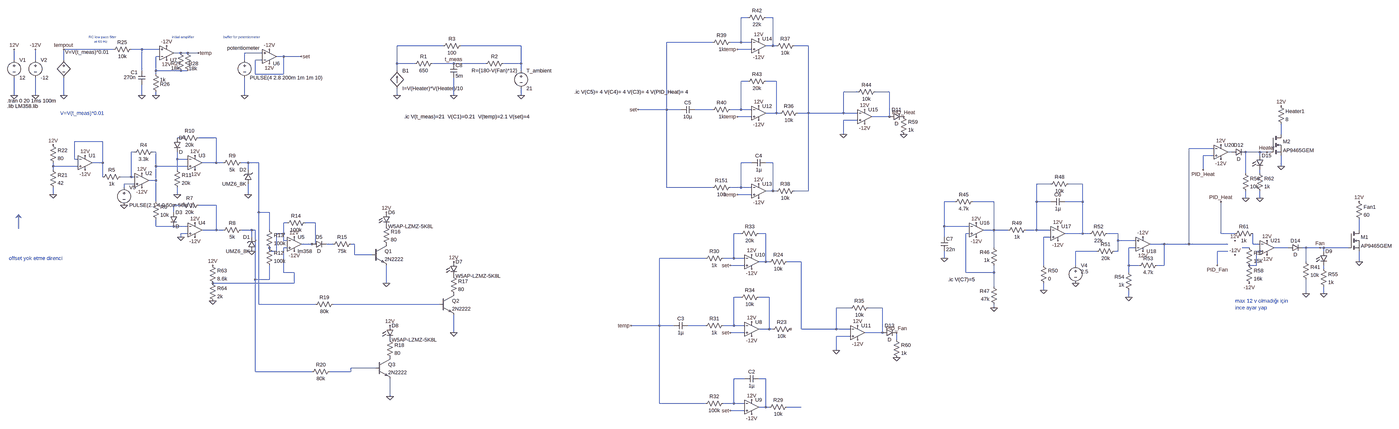
[diagram p0: schematic TRANSFORMERS-ASSEMBLE-3.asc, whole sheet]
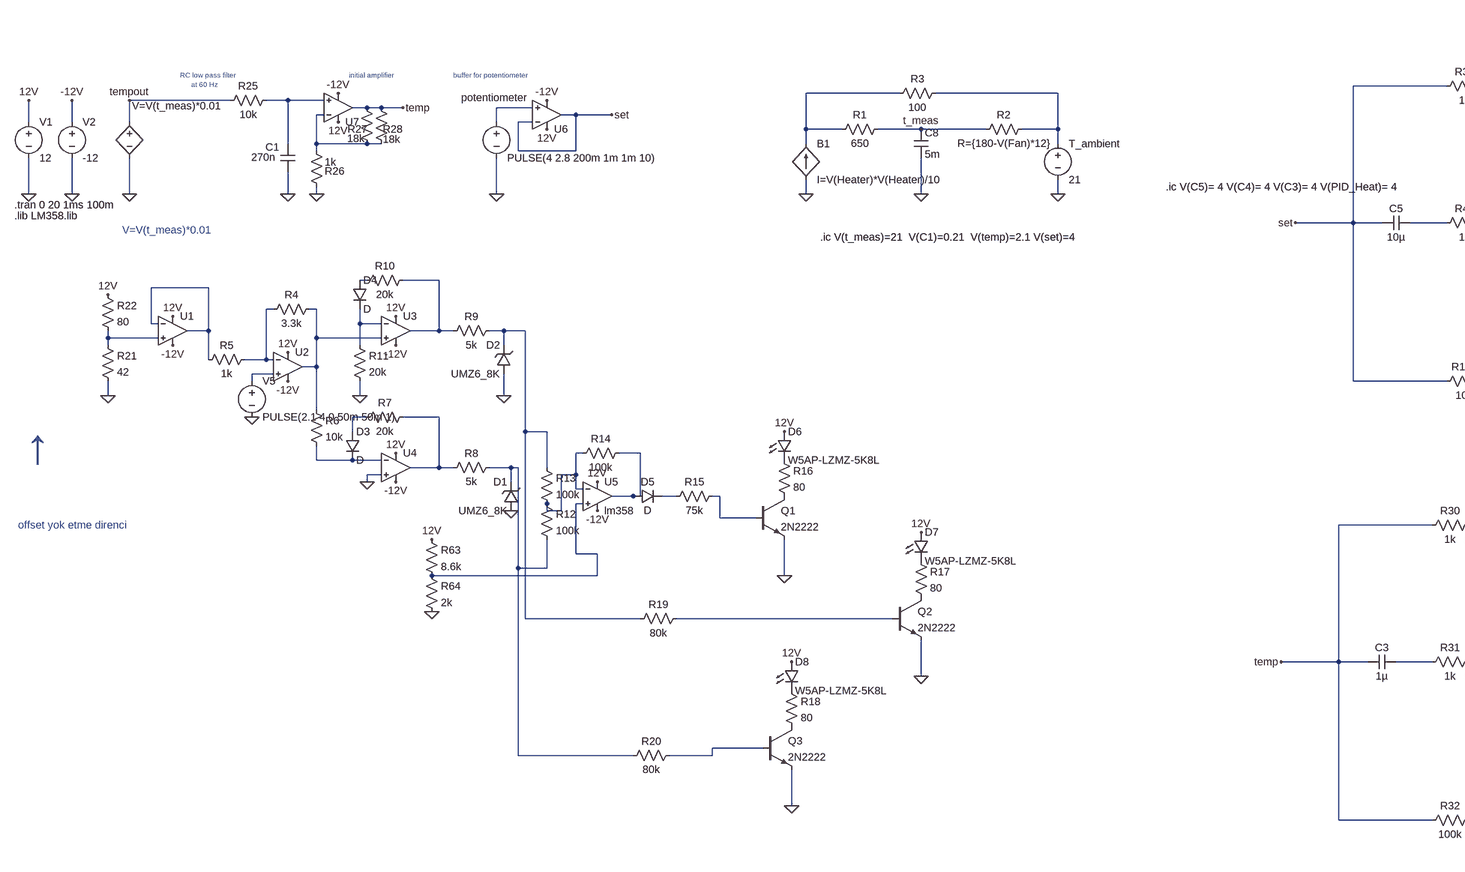
[diagram p1: schematic TRANSFORMERS-ASSEMBLE-3.asc, part, row 1 of 1, column 1 of 2]
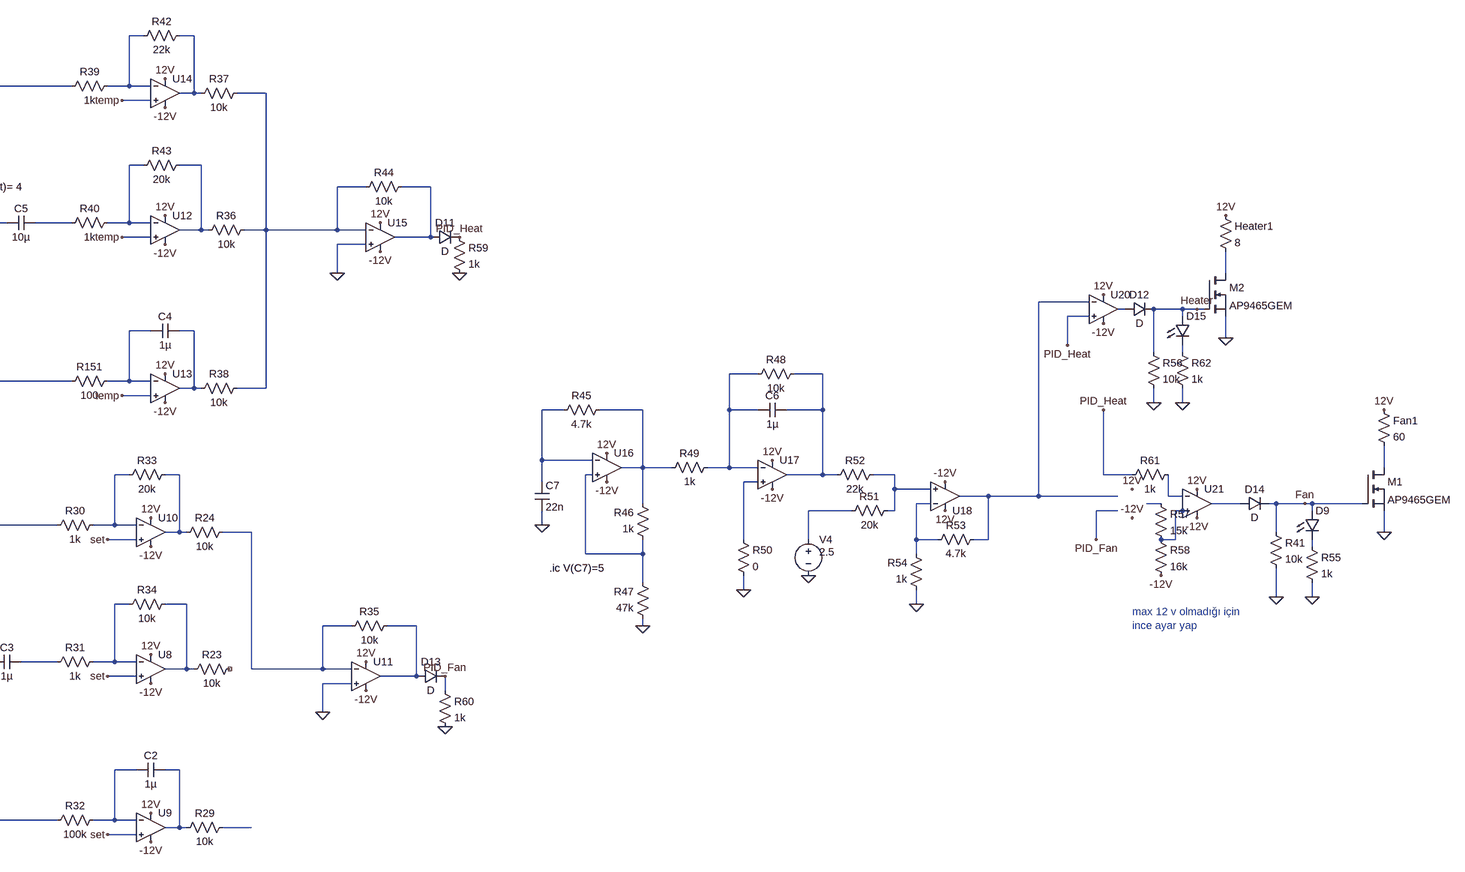
[diagram p2: schematic TRANSFORMERS-ASSEMBLE-3.asc, part, row 1 of 1, column 2 of 2]
TRANSFORMERS-ASSEMBLE-3.asc, the LTspice schematic file:
Version 4
SHEET 1 5384 1732
WIRE 2224 -160 2192 -160
WIRE 2336 -160 2304 -160
WIRE 2064 -48 1856 -48
WIRE 2192 -48 2192 -160
WIRE 2192 -48 2144 -48
WIRE 2240 -48 2192 -48
WIRE 576 -32 368 -32
WIRE 928 -32 656 -32
WIRE 2336 -32 2336 -160
WIRE 2336 -32 2304 -32
WIRE 2352 -32 2336 -32
WIRE 2496 -32 2432 -32
WIRE -912 -16 -1136 -16
WIRE -784 -16 -832 -16
WIRE -704 -16 -784 -16
WIRE 2240 -16 2176 -16
WIRE -608 0 -640 0
WIRE -576 0 -608 0
WIRE -528 0 -576 0
WIRE -240 0 -320 0
WIRE -704 16 -720 16
WIRE -144 16 -176 16
WIRE -64 16 -144 16
WIRE -1360 32 -1360 -16
WIRE -1264 32 -1264 -16
WIRE -1136 32 -1136 -16
WIRE -320 32 -320 0
WIRE -240 32 -272 32
WIRE 368 48 368 -32
WIRE 448 48 368 48
WIRE 624 48 528 48
WIRE 768 48 624 48
WIRE 928 48 928 -32
WIRE 928 48 848 48
WIRE -784 80 -784 -16
WIRE -720 80 -720 16
WIRE -608 80 -720 80
WIRE -576 80 -608 80
WIRE 368 80 368 48
WIRE 928 80 928 48
WIRE -720 96 -720 80
WIRE -272 96 -272 32
WIRE -144 96 -144 16
WIRE -144 96 -272 96
WIRE 2224 128 2192 128
WIRE 2352 128 2304 128
WIRE 2720 176 2656 176
WIRE 2864 176 2800 176
WIRE -1360 192 -1360 112
WIRE -1264 192 -1264 112
WIRE -1136 192 -1136 112
WIRE -784 192 -784 144
WIRE -720 192 -720 176
WIRE -320 192 -320 112
WIRE 368 192 368 160
WIRE 624 192 624 112
WIRE 928 192 928 160
WIRE 1856 256 1856 -48
WIRE 1856 256 1728 256
WIRE 1920 256 1856 256
WIRE 2064 256 1984 256
WIRE 2192 256 2192 128
WIRE 2192 256 2144 256
WIRE 2240 256 2192 256
WIRE 2352 272 2352 128
WIRE 2352 272 2304 272
WIRE 2368 272 2352 272
WIRE 2496 272 2496 -32
WIRE 2496 272 2448 272
WIRE 2656 272 2656 176
WIRE 2656 272 2496 272
WIRE 2720 272 2656 272
WIRE 2240 288 2176 288
WIRE 2864 288 2864 176
WIRE 2864 288 2784 288
WIRE 2720 304 2656 304
WIRE 2656 368 2656 304
WIRE 4880 368 4880 320
WIRE -608 384 -624 384
WIRE -448 384 -528 384
WIRE -960 400 -1088 400
WIRE 4576 432 4464 432
WIRE -816 448 -832 448
WIRE -720 448 -736 448
WIRE 4656 448 4640 448
WIRE 4784 448 4720 448
WIRE 4816 448 4784 448
WIRE 4832 448 4816 448
WIRE 4576 464 4528 464
WIRE 4784 464 4784 448
WIRE -1088 480 -1088 400
WIRE -1072 480 -1088 480
WIRE -624 480 -624 448
WIRE -576 480 -624 480
WIRE -960 496 -960 400
WIRE -960 496 -1008 496
WIRE -448 496 -448 384
WIRE -448 496 -512 496
WIRE -416 496 -448 496
WIRE -304 496 -336 496
WIRE -256 496 -304 496
WIRE 2240 496 2192 496
WIRE 2336 496 2304 496
WIRE -1184 512 -1184 496
WIRE -1072 512 -1184 512
WIRE -720 512 -720 448
WIRE -576 512 -720 512
WIRE 4880 512 4880 464
WIRE -1184 528 -1184 512
WIRE -624 528 -624 480
WIRE -304 528 -304 496
WIRE 4528 528 4528 464
WIRE 4720 544 4720 448
WIRE 4784 544 4784 528
WIRE -960 560 -960 496
WIRE -832 560 -832 448
WIRE -832 560 -880 560
WIRE -816 560 -832 560
WIRE -720 576 -720 512
WIRE -720 576 -752 576
WIRE -816 592 -864 592
WIRE 3840 592 3776 592
WIRE 3984 592 3920 592
WIRE -864 608 -864 592
WIRE 1856 608 1856 256
WIRE 2064 608 1856 608
WIRE 2192 608 2192 496
WIRE 2192 608 2144 608
WIRE 2240 608 2192 608
WIRE 2336 624 2336 496
WIRE 2336 624 2304 624
WIRE 2352 624 2336 624
WIRE 2496 624 2496 272
WIRE 2496 624 2432 624
WIRE -1184 640 -1184 608
WIRE -624 640 -624 608
WIRE -304 640 -304 592
WIRE 2240 640 2176 640
WIRE 4720 656 4720 624
WIRE 4784 656 4784 624
WIRE -720 672 -720 576
WIRE 3408 672 3360 672
WIRE 3584 672 3488 672
WIRE 3776 672 3776 592
WIRE 3840 672 3776 672
WIRE 3984 672 3984 592
WIRE 3984 672 3904 672
WIRE -608 688 -640 688
WIRE -448 688 -528 688
WIRE -640 720 -640 688
WIRE -256 720 -256 496
WIRE -208 720 -256 720
WIRE -128 768 -144 768
WIRE 0 768 -48 768
WIRE -720 784 -720 752
WIRE -640 784 -720 784
WIRE -576 784 -640 784
WIRE 3360 784 3360 672
WIRE 3472 784 3360 784
WIRE -448 800 -448 688
WIRE -448 800 -512 800
WIRE -416 800 -448 800
WIRE -288 800 -336 800
WIRE -272 800 -288 800
WIRE -208 800 -208 720
WIRE 3584 800 3584 672
WIRE 3584 800 3536 800
WIRE 3648 800 3584 800
WIRE 3776 800 3776 672
WIRE 3776 800 3728 800
WIRE 3840 800 3776 800
WIRE 5232 800 5232 752
WIRE -576 816 -608 816
WIRE -144 816 -144 768
WIRE -144 816 -176 816
WIRE 2192 816 2160 816
WIRE 2304 816 2272 816
WIRE 3472 816 3456 816
WIRE 3984 816 3984 672
WIRE 3984 816 3904 816
WIRE 4016 816 3984 816
WIRE 4144 816 4096 816
WIRE 4608 816 4608 672
WIRE 4672 816 4608 816
WIRE -608 832 -608 816
WIRE -288 832 -288 800
WIRE 3360 832 3360 784
WIRE 3840 832 3808 832
WIRE -144 848 -144 816
WIRE -128 848 -144 848
WIRE 4144 848 4144 816
WIRE 4224 848 4144 848
WIRE -16 864 -64 864
WIRE 0 864 0 768
WIRE 0 864 -16 864
WIRE 80 864 48 864
WIRE 176 864 160 864
WIRE 4352 864 4288 864
WIRE 4464 864 4464 432
WIRE 4464 864 4352 864
WIRE 4640 864 4464 864
WIRE 4752 864 4752 816
WIRE 4784 864 4752 864
WIRE -128 880 -144 880
WIRE 3584 880 3584 800
WIRE 4224 880 4192 880
WIRE 4736 880 4704 880
WIRE 4912 880 4848 880
WIRE 4992 880 4976 880
WIRE 5056 880 4992 880
WIRE 5072 880 5056 880
WIRE 5184 880 5072 880
WIRE -208 896 -208 880
WIRE -176 896 -176 816
WIRE -176 896 -208 896
WIRE 4048 896 3952 896
WIRE 4144 896 4144 848
WIRE 4144 896 4128 896
WIRE 4640 896 4592 896
WIRE 4784 896 4768 896
WIRE 4800 896 4784 896
WIRE 5072 896 5072 880
WIRE 176 912 176 864
WIRE 256 912 176 912
WIRE 2032 928 1824 928
WIRE 2160 928 2160 816
WIRE 2160 928 2112 928
WIRE 2208 928 2160 928
WIRE 3360 928 3360 896
WIRE 2304 944 2304 816
WIRE 2304 944 2272 944
WIRE 2320 944 2304 944
WIRE 2464 944 2400 944
WIRE 4992 944 4992 880
WIRE 5232 944 5232 896
WIRE 2208 960 2144 960
WIRE 3808 960 3808 832
WIRE 3952 960 3952 896
WIRE 4192 960 4192 880
WIRE 4240 960 4192 960
WIRE 4352 960 4352 864
WIRE 4352 960 4320 960
WIRE 4592 960 4592 896
WIRE 4768 960 4768 896
WIRE 4768 960 4736 960
WIRE 5072 976 5072 960
WIRE -144 992 -144 880
WIRE -96 992 -144 992
WIRE 3456 992 3456 816
WIRE 3584 992 3584 960
WIRE 3584 992 3456 992
WIRE 4192 992 4192 960
WIRE -272 1024 -272 800
WIRE -208 1024 -208 960
WIRE -208 1024 -272 1024
WIRE -96 1040 -96 992
WIRE -96 1040 -464 1040
WIRE 320 1040 320 960
WIRE 3584 1056 3584 992
WIRE 3808 1072 3808 1040
WIRE 4992 1088 4992 1024
WIRE 5072 1088 5072 1056
WIRE 2192 1104 2160 1104
WIRE 2320 1104 2272 1104
WIRE 4192 1104 4192 1072
WIRE -256 1136 -256 720
WIRE 0 1136 -256 1136
WIRE 560 1136 80 1136
WIRE 2688 1152 2624 1152
WIRE 2832 1152 2768 1152
WIRE 3584 1152 3584 1136
WIRE 1824 1232 1824 928
WIRE 1824 1232 1696 1232
WIRE 1888 1232 1824 1232
WIRE 2032 1232 1952 1232
WIRE 2160 1232 2160 1104
WIRE 2160 1232 2112 1232
WIRE 2208 1232 2160 1232
WIRE 2320 1248 2320 1104
WIRE 2320 1248 2272 1248
WIRE 2336 1248 2320 1248
WIRE 2464 1248 2464 944
WIRE 2624 1248 2624 1152
WIRE 2624 1248 2464 1248
WIRE 2688 1248 2624 1248
WIRE 624 1264 624 1184
WIRE 2208 1264 2144 1264
WIRE 2832 1264 2832 1152
WIRE 2832 1264 2752 1264
WIRE 2688 1280 2624 1280
WIRE 2896 1296 2896 1264
WIRE 2624 1344 2624 1280
WIRE 272 1424 160 1424
WIRE -272 1440 -272 1024
WIRE -16 1440 -272 1440
WIRE 160 1440 160 1424
WIRE 160 1440 64 1440
WIRE 2208 1472 2160 1472
WIRE 2304 1472 2272 1472
WIRE 336 1552 336 1472
WIRE 1824 1584 1824 1232
WIRE 2032 1584 1824 1584
WIRE 2160 1584 2160 1472
WIRE 2160 1584 2112 1584
WIRE 2208 1584 2160 1584
WIRE 2304 1600 2304 1472
WIRE 2304 1600 2272 1600
WIRE 2320 1600 2304 1600
WIRE 2464 1600 2400 1600
WIRE 2208 1616 2144 1616
FLAG -1360 192 0
FLAG -1360 -16 12V
FLAG -1264 192 0
FLAG -1264 -16 -12V
FLAG -1136 192 0
FLAG -672 -32 -12V
FLAG -672 32 12V
FLAG -784 192 0
FLAG -720 192 0
FLAG -528 0 temp
FLAG -320 192 0
FLAG -208 -16 -12V
FLAG -208 48 12V
FLAG -64 16 set
FLAG 928 192 0
FLAG 368 192 0
FLAG 624 192 0
FLAG -784 608 -12V
FLAG -784 544 12V
FLAG -1184 640 0
FLAG -1184 416 12V
FLAG -608 832 0
FLAG -544 832 -12V
FLAG -544 768 12V
FLAG -288 896 0
FLAG -304 640 0
FLAG -544 528 -12V
FLAG -544 464 12V
FLAG -624 640 0
FLAG -96 896 -12V
FLAG -96 832 12V
FLAG 320 1040 0
FLAG 320 720 12V
FLAG 624 1264 0
FLAG 624 944 12V
FLAG 336 1552 0
FLAG 336 1232 12V
FLAG -1040 528 -12V
FLAG -1040 464 12V
FLAG 624 48 t_meas
FLAG -1136 -16 tempout
FLAG 2240 1280 -12V
FLAG 2240 1216 12V
FLAG 2240 1632 -12V
FLAG 2240 1568 12V
FLAG 2240 976 -12V
FLAG 2240 912 12V
FLAG 2720 1232 12V
FLAG 2624 1344 0
FLAG 2896 1264 PID_Fan
FLAG 2272 304 -12V
FLAG 2272 240 12V
FLAG 2272 656 -12V
FLAG 2272 592 12V
FLAG 2272 0 -12V
FLAG 2272 -64 12V
FLAG 2752 320 -12V
FLAG 2752 256 12V
FLAG 1728 256 set
FLAG 2656 368 0
FLAG 2928 288 PID_Heat
FLAG 3504 832 -12V
FLAG 3504 768 12V
FLAG 3360 928 0
FLAG 3584 1152 0
FLAG 3808 1072 0
FLAG 3872 848 -12V
FLAG 3872 784 12V
FLAG 4256 832 -12V
FLAG 4256 896 12V
FLAG 4192 1104 0
FLAG 4672 912 -12V
FLAG 4672 848 12V
FLAG 4592 960 PID_Fan
FLAG 5056 880 Fan
FLAG 5232 944 0
FLAG 5072 1088 0
FLAG 4608 480 -12V
FLAG 4608 416 12V
FLAG 4528 528 PID_Heat
FLAG 4816 448 Heater
FLAG 4880 512 0
FLAG 4720 656 0
FLAG 5232 672 12V
FLAG 4880 240 12V
FLAG 4816 912 -12V
FLAG 4816 848 12V
FLAG 4608 672 PID_Heat
FLAG 4736 1040 -12V
FLAG 3952 1040 0
FLAG 2176 -16 temp
FLAG 2176 288 temp
FLAG 2176 640 temp
FLAG 2928 368 0
FLAG 2896 1376 0
FLAG 2720 1296 -12V
FLAG 4992 1088 0
FLAG 2144 960 set
FLAG 2144 1264 set
FLAG 2144 1616 set
FLAG 1696 1232 temp
FLAG 4784 656 0
FLAG -864 688 0
FLAG -464 1120 0
FLAG -464 960 12V
SYMBOL voltage -1360 16 R0
SYMATTR InstName V1
SYMATTR Value 12
SYMBOL voltage -1264 16 R0
WINDOW 123 0 0 Left 0
WINDOW 39 0 0 Left 0
SYMATTR InstName V2
SYMATTR Value -12
SYMBOL bv -1136 16 R0
WINDOW 0 -36 10 Invisible 2
WINDOW 3 6 -20 Left 2
SYMATTR InstName B2
SYMATTR Value V=V(t_meas)*0.01
SYMBOL res -816 -32 R90
WINDOW 0 0 56 VBottom 2
WINDOW 3 32 56 VTop 2
SYMATTR InstName R25
SYMATTR Value 10k
SYMBOL cap -800 80 R0
WINDOW 0 -34 8 Left 2
WINDOW 3 -65 30 Left 2
SYMATTR InstName C1
SYMATTR Value 270n
SYMBOL res -736 80 R0
WINDOW 0 34 61 Left 2
WINDOW 3 34 41 Left 2
SYMATTR InstName R26
SYMATTR Value 1k
SYMBOL res -624 -16 R0
WINDOW 0 -27 64 Left 2
WINDOW 3 -28 85 Left 2
SYMATTR InstName R27
SYMATTR Value 18k
SYMBOL res -592 -16 R0
WINDOW 0 19 64 Left 2
WINDOW 3 19 86 Left 2
SYMATTR InstName R28
SYMATTR Value 18k
SYMBOL voltage -320 16 R0
WINDOW 0 -79 -38 Left 2
WINDOW 123 0 0 Left 0
WINDOW 39 0 0 Left 0
SYMATTR InstName potentiometer
SYMATTR Value PULSE(4 2.8 200m 1m 1m 10)
SYMBOL voltage 928 64 R0
WINDOW 123 0 0 Left 0
WINDOW 39 0 0 Left 0
SYMATTR InstName T_ambient
SYMATTR Value 21
SYMBOL res 544 32 R90
WINDOW 0 0 56 VBottom 2
WINDOW 3 32 56 VTop 2
SYMATTR InstName R1
SYMATTR Value 650
SYMBOL res 864 32 R90
WINDOW 0 0 56 VBottom 2
WINDOW 3 32 56 VTop 2
SYMATTR InstName R2
SYMATTR Value R={180-V(Fan)*12}
SYMBOL res 672 -48 R90
WINDOW 0 0 56 VBottom 2
WINDOW 3 32 56 VTop 2
SYMATTR InstName R3
SYMATTR Value 100
SYMBOL res -720 432 R90
WINDOW 0 0 56 VBottom 2
WINDOW 3 32 56 VTop 2
SYMATTR InstName R4
SYMATTR Value 3.3k
SYMBOL res -864 544 R90
WINDOW 0 0 56 VBottom 2
WINDOW 3 32 56 VTop 2
SYMATTR InstName R5
SYMATTR Value 1k
SYMBOL res -736 656 R0
SYMATTR InstName R6
SYMATTR Value 10k
SYMBOL res -512 672 R90
WINDOW 0 0 56 VBottom 2
WINDOW 3 32 56 VTop 2
SYMATTR InstName R7
SYMATTR Value 20k
SYMBOL zener -272 896 R180
WINDOW 0 24 64 Left 2
WINDOW 3 24 0 Left 2
SYMATTR InstName D1
SYMATTR Value UMZ6_8K
SYMBOL res -320 784 R90
WINDOW 0 0 56 VBottom 2
WINDOW 3 32 56 VTop 2
SYMATTR InstName R8
SYMATTR Value 5k
SYMBOL zener -288 592 R180
WINDOW 0 24 64 Left 2
WINDOW 3 24 0 Left 2
SYMATTR InstName D2
SYMATTR Value UMZ6_8K
SYMBOL res -320 480 R90
WINDOW 0 0 56 VBottom 2
WINDOW 3 32 56 VTop 2
SYMATTR InstName R9
SYMATTR Value 5k
SYMBOL res -512 368 R90
WINDOW 0 0 56 VBottom 2
WINDOW 3 32 56 VTop 2
SYMATTR InstName R10
SYMATTR Value 20k
SYMBOL res -640 512 R0
SYMATTR InstName R11
SYMATTR Value 20k
SYMBOL diode -656 720 R0
SYMATTR InstName D3
SYMBOL diode -640 384 R0
SYMATTR InstName D4
SYMBOL res -224 864 R0
SYMATTR InstName R12
SYMATTR Value 100k
SYMBOL res -224 784 R0
SYMATTR InstName R13
SYMATTR Value 100k
SYMBOL res -32 752 R90
WINDOW 0 0 56 VBottom 2
WINDOW 3 32 56 VTop 2
SYMATTR InstName R14
SYMATTR Value 100k
SYMBOL diode -16 880 R270
WINDOW 0 32 32 VTop 2
WINDOW 3 0 32 VBottom 2
SYMATTR InstName D5
SYMBOL npn 256 864 R0
SYMATTR InstName Q1
SYMATTR Value 2N2222
SYMBOL res 176 848 R90
WINDOW 0 0 56 VBottom 2
WINDOW 3 32 56 VTop 2
SYMATTR InstName R15
SYMATTR Value 75k
SYMBOL LED 304 720 R0
SYMATTR InstName D6
SYMATTR Value W5AP-LZMZ-5K8L
SYMATTR Description Diode
SYMATTR Type diode
SYMBOL res 304 768 R0
SYMATTR InstName R16
SYMATTR Value 80
SYMBOL npn 560 1088 R0
SYMATTR InstName Q2
SYMATTR Value 2N2222
SYMBOL LED 608 944 R0
SYMATTR InstName D7
SYMATTR Value W5AP-LZMZ-5K8L
SYMATTR Description Diode
SYMATTR Type diode
SYMBOL res 608 992 R0
SYMATTR InstName R17
SYMATTR Value 80
SYMBOL npn 272 1376 R0
SYMATTR InstName Q3
SYMATTR Value 2N2222
SYMBOL LED 320 1232 R0
SYMATTR InstName D8
SYMATTR Value W5AP-LZMZ-5K8L
SYMATTR Description Diode
SYMATTR Type diode
SYMBOL res 320 1280 R0
SYMATTR InstName R18
SYMATTR Value 80
SYMBOL res 96 1120 R90
WINDOW 0 0 56 VBottom 2
WINDOW 3 32 56 VTop 2
SYMATTR InstName R19
SYMATTR Value 80k
SYMBOL res 80 1424 R90
WINDOW 0 0 56 VBottom 2
WINDOW 3 32 56 VTop 2
SYMATTR InstName R20
SYMATTR Value 80k
SYMBOL res -1200 512 R0
SYMATTR InstName R21
SYMATTR Value 42
SYMBOL res -1200 400 R0
SYMATTR InstName R22
SYMATTR Value 80
SYMBOL Opamps\\UniversalOpamp2 -1040 496 R0
SYMATTR InstName U1
SYMBOL Opamps\\UniversalOpamp2 -784 576 R0
SYMATTR InstName U2
SYMBOL Opamps\\UniversalOpamp2 -544 496 R0
SYMATTR InstName U3
SYMBOL Opamps\\UniversalOpamp2 -544 800 R0
SYMATTR InstName U4
SYMBOL Opamps\\UniversalOpamp2 2240 1248 R0
SYMATTR InstName U8
SYMBOL Opamps\\UniversalOpamp2 2240 1600 R0
SYMATTR InstName U9
SYMBOL Opamps\\UniversalOpamp2 2240 944 R0
SYMATTR InstName U10
SYMBOL Opamps\\UniversalOpamp2 2720 1264 R0
SYMATTR InstName U11
SYMBOL res 2432 1232 R90
WINDOW 0 0 56 VBottom 2
WINDOW 3 32 56 VTop 2
SYMATTR InstName R23
SYMATTR Value 10k
SYMBOL res 2416 928 R90
WINDOW 0 0 56 VBottom 2
WINDOW 3 32 56 VTop 2
SYMATTR InstName R24
SYMATTR Value 10k
SYMBOL res 2416 1584 R90
WINDOW 0 0 56 VBottom 2
WINDOW 3 32 56 VTop 2
SYMATTR InstName R29
SYMATTR Value 10k
SYMBOL res 2128 912 R90
WINDOW 0 0 56 VBottom 2
WINDOW 3 32 56 VTop 2
SYMATTR InstName R30
SYMATTR Value 1k
SYMBOL res 2128 1216 R90
WINDOW 0 0 56 VBottom 2
WINDOW 3 32 56 VTop 2
SYMATTR InstName R31
SYMATTR Value 1k
SYMBOL res 2128 1568 R90
WINDOW 0 0 56 VBottom 2
WINDOW 3 32 56 VTop 2
SYMATTR InstName R32
SYMATTR Value 100k
SYMBOL res 2288 800 R90
WINDOW 0 0 56 VBottom 2
WINDOW 3 32 56 VTop 2
SYMATTR InstName R33
SYMATTR Value 20k
SYMBOL res 2288 1088 R90
WINDOW 0 0 56 VBottom 2
WINDOW 3 32 56 VTop 2
SYMATTR InstName R34
SYMATTR Value 10k
SYMBOL cap 2272 1456 R90
WINDOW 0 0 32 VBottom 2
WINDOW 3 32 32 VTop 2
SYMATTR InstName C2
SYMATTR Value 1µ
SYMBOL cap 1952 1216 R90
WINDOW 0 0 32 VBottom 2
WINDOW 3 32 32 VTop 2
SYMATTR InstName C3
SYMATTR Value 1µ
SYMBOL res 2784 1136 R90
WINDOW 0 0 56 VBottom 2
WINDOW 3 32 56 VTop 2
SYMATTR InstName R35
SYMATTR Value 10k
SYMBOL Opamps\\UniversalOpamp2 2272 272 R0
SYMATTR InstName U12
SYMBOL Opamps\\UniversalOpamp2 2272 624 R0
SYMATTR InstName U13
SYMBOL Opamps\\UniversalOpamp2 2272 -32 R0
SYMATTR InstName U14
SYMBOL Opamps\\UniversalOpamp2 2752 288 R0
SYMATTR InstName U15
SYMBOL res 2448 -48 R90
WINDOW 0 0 56 VBottom 2
WINDOW 3 32 56 VTop 2
SYMATTR InstName R37
SYMATTR Value 10k
SYMBOL res 2448 608 R90
WINDOW 0 0 56 VBottom 2
WINDOW 3 32 56 VTop 2
SYMATTR InstName R38
SYMATTR Value 10k
SYMBOL res 2160 -64 R90
WINDOW 0 0 56 VBottom 2
WINDOW 3 32 56 VTop 2
SYMATTR InstName R39
SYMATTR Value 1k
SYMBOL res 2160 240 R90
WINDOW 0 0 56 VBottom 2
WINDOW 3 32 56 VTop 2
SYMATTR InstName R40
SYMATTR Value 1k
SYMBOL res 2160 592 R90
WINDOW 0 0 56 VBottom 2
WINDOW 3 32 56 VTop 2
SYMATTR InstName R151
SYMATTR Value 100
SYMBOL res 2320 -176 R90
WINDOW 0 0 56 VBottom 2
WINDOW 3 32 56 VTop 2
SYMATTR InstName R42
SYMATTR Value 22k
SYMBOL res 2320 112 R90
WINDOW 0 0 56 VBottom 2
WINDOW 3 32 56 VTop 2
SYMATTR InstName R43
SYMATTR Value 20k
SYMBOL cap 2304 480 R90
WINDOW 0 0 32 VBottom 2
WINDOW 3 32 32 VTop 2
SYMATTR InstName C4
SYMATTR Value 1µ
SYMBOL cap 1984 240 R90
WINDOW 0 0 32 VBottom 2
WINDOW 3 32 32 VTop 2
SYMATTR InstName C5
SYMATTR Value 10µ
SYMBOL res 2816 160 R90
WINDOW 0 0 56 VBottom 2
WINDOW 3 32 56 VTop 2
SYMATTR InstName R44
SYMATTR Value 10k
SYMBOL cap 3904 656 R90
WINDOW 0 0 32 VBottom 2
WINDOW 3 32 32 VTop 2
SYMATTR InstName C6
SYMATTR Value 1µ
SYMBOL res 3504 656 R90
WINDOW 0 0 56 VBottom 2
WINDOW 3 32 56 VTop 2
SYMATTR InstName R45
SYMATTR Value 4.7k
SYMBOL res 3600 976 R180
WINDOW 0 36 76 Left 2
WINDOW 3 36 40 Left 2
SYMATTR InstName R46
SYMATTR Value 1k
SYMBOL res 3600 1152 R180
WINDOW 0 36 76 Left 2
WINDOW 3 36 40 Left 2
SYMATTR InstName R47
SYMATTR Value 47k
SYMBOL res 3936 576 R90
WINDOW 0 0 56 VBottom 2
WINDOW 3 32 56 VTop 2
SYMATTR InstName R48
SYMATTR Value 10k
SYMBOL Opamps\\UniversalOpamp2 3504 800 R0
SYMATTR InstName U16
SYMBOL res 3744 784 R90
WINDOW 0 0 56 VBottom 2
WINDOW 3 32 56 VTop 2
SYMATTR InstName R49
SYMATTR Value 1k
SYMBOL res 3792 944 R0
SYMATTR InstName R50
SYMATTR Value 0
SYMBOL res 4144 880 R90
WINDOW 0 0 56 VBottom 2
WINDOW 3 32 56 VTop 2
SYMATTR InstName R51
SYMATTR Value 20k
SYMBOL res 4000 832 R270
WINDOW 0 32 56 VTop 2
WINDOW 3 0 56 VBottom 2
SYMATTR InstName R52
SYMATTR Value 22k
SYMBOL Opamps\\UniversalOpamp2 3872 816 R0
SYMATTR InstName U17
SYMBOL Opamps\\UniversalOpamp2 4256 864 M180
SYMATTR InstName U18
SYMBOL res 4336 944 R90
WINDOW 0 0 56 VBottom 2
WINDOW 3 32 56 VTop 2
SYMATTR InstName R53
SYMATTR Value 4.7k
SYMBOL res 4208 1088 R180
WINDOW 0 36 76 Left 2
WINDOW 3 36 40 Left 2
SYMATTR InstName R54
SYMATTR Value 1k
SYMBOL nmos 5184 800 R0
SYMATTR InstName M1
SYMATTR Value AP9465GEM
SYMBOL LED 5056 896 R0
WINDOW 3 24 64 Invisible 2
SYMATTR Value NSSW008CT-P1
SYMATTR InstName D9
SYMATTR Description Diode
SYMATTR Type diode
SYMBOL res 5056 960 R0
SYMATTR InstName R55
SYMATTR Value 1k
SYMBOL res 5216 656 R0
SYMATTR InstName Fan1
SYMATTR Value 60
SYMBOL Opamps\\UniversalOpamp2 4608 448 R0
SYMATTR InstName U20
SYMBOL nmos 4832 368 R0
SYMATTR InstName M2
SYMATTR Value AP9465GEM
SYMBOL res 4704 528 R0
SYMATTR InstName R56
SYMATTR Value 10k
SYMBOL res 4864 224 R0
SYMATTR InstName Heater1
SYMATTR Value 8
SYMBOL Opamps\\UniversalOpamp2 4816 880 R0
SYMATTR InstName U21
SYMBOL res 4720 864 R0
SYMATTR InstName R57
SYMATTR Value 15k
SYMBOL res 4720 944 R0
SYMATTR InstName R58
SYMATTR Value 16k
SYMBOL voltage 3952 944 R0
WINDOW 123 0 0 Left 0
WINDOW 39 0 0 Left 0
WINDOW 3 24 44 Left 2
SYMATTR Value 2.5
SYMATTR InstName V4
SYMBOL cap 3344 832 R0
SYMATTR InstName C7
SYMATTR Value 22n
SYMBOL cap 608 48 R0
SYMATTR InstName C8
SYMATTR Value 5m
SYMBOL bi2 368 80 R0
SYMATTR InstName B1
SYMATTR Value I=V(Heater)*V(Heater)/10
SYMBOL diode 4656 464 R270
WINDOW 0 32 32 VTop 2
WINDOW 3 0 32 VBottom 2
SYMATTR InstName D12
SYMBOL diode 2864 304 R270
WINDOW 0 32 32 VTop 2
WINDOW 3 0 32 VBottom 2
SYMATTR InstName D11
SYMBOL diode 2832 1280 R270
WINDOW 0 32 32 VTop 2
WINDOW 3 0 32 VBottom 2
SYMATTR InstName D13
SYMBOL diode 4912 896 R270
WINDOW 0 32 32 VTop 2
WINDOW 3 0 32 VBottom 2
SYMATTR InstName D14
SYMBOL res 2912 272 R0
SYMATTR InstName R59
SYMATTR Value 1k
SYMBOL res 2880 1280 R0
SYMATTR InstName R60
SYMATTR Value 1k
SYMBOL Opamps\\UniversalOpamp2 -208 16 M180
SYMATTR InstName U6
SYMBOL Opamps\\UniversalOpamp2 -672 0 M180
SYMATTR InstName U7
SYMBOL res 4976 928 R0
SYMATTR InstName R41
SYMATTR Value 10k
SYMBOL res 4768 800 R90
WINDOW 0 0 56 VBottom 2
WINDOW 3 32 56 VTop 2
SYMATTR InstName R61
SYMATTR Value 1k
SYMBOL res 4768 528 R0
SYMATTR InstName R62
SYMATTR Value 1k
SYMBOL LED 4768 464 R0
WINDOW 3 24 64 Invisible 2
SYMATTR Value NSSW008CT-P1
SYMATTR InstName D15
SYMATTR Description Diode
SYMATTR Type diode
SYMBOL res 2464 256 R90
WINDOW 0 0 56 VBottom 2
WINDOW 3 32 56 VTop 2
SYMATTR InstName R36
SYMATTR Value 10k
SYMBOL voltage -864 592 R0
WINDOW 123 0 0 Left 0
WINDOW 39 0 0 Left 0
SYMATTR InstName V5
SYMATTR Value PULSE(2.1 4 0 50m 50m 1)
SYMBOL res -480 944 R0
SYMATTR InstName R63
SYMATTR Value 8.6k
SYMBOL res -480 1024 R0
SYMATTR InstName R64
SYMATTR Value 2k
SYMBOL Opamps\\opamp2 -96 800 R0
SYMATTR InstName U5
SYMATTR Value lm358
TEXT -1024 -72 Left 1 ;RC low pass filter\n      at 60 Hz
TEXT -648 -72 Left 1 ;initial amplifier
TEXT -416 -72 Left 1 ;buffer for potentiometer
TEXT -1392 216 Left 2 !.tran 0 20 1ms 100m
TEXT -1392 240 Left 2 !.lib LM358.lib
TEXT -1384 928 Left 2 ;offset yok etme direnci
TEXT -1368 752 Left 7 ;↑
TEXT 400 288 Left 2 !.ic V(t_meas)=21  V(C1)=0.21  V(temp)=2.1 V(set)=4
TEXT -1152 272 Left 2 ;V=V(t_meas)*0.01
TEXT 3376 1024 Left 2 !.ic V(C7)=5
TEXT 1440 176 Left 2 !.ic V(C5)= 4 V(C4)= 4 V(C3)= 4 V(PID_Heat)= 4
TEXT 4672 1120 Left 2 ;max 12 v olmadığı için\nince ayar yap

The netlist it stands for:
* TRANSFORMERS-ASSEMBLE-3.asc
V1 12V 0 12
V2 -12V 0 -12
B2 tempout 0 V=V(t_meas)*0.01
R25 N006 tempout 10k
C1 N006 0 270n
R26 N008 0 1k
R27 temp N008 18k
R28 temp N008 18k
V§potentiometer N007 0 PULSE(4 2.8 200m 1m 1m 10)
V§T_ambient N004 0 21
R1 t_meas N003 650
R2 N004 t_meas R={180-V(Fan)*12}
R3 N004 N003 100
R4 N019 N018 3.3k
R5 N018 N016 1k
R6 N019 N036 10k
R7 N033 N032 20k
D1 0 N037 UMZ6_8K
R8 N037 N033 5k
D2 0 N022 UMZ6_8K
R9 N022 N015 5k
R10 N015 N014 20k
R11 N021 0 20k
D3 N032 N036 D
D4 N014 N021 D
R12 N034 N037 100k
R13 N022 N034 100k
R14 N035 N034 100k
D5 N035 N044 D
Q1 P001 N045 0 0 2N2222
R15 N045 N044 75k
D6 12V P002 W5AP-LZMZ-5K8L
R16 P002 P001 80
Q2 P003 N057 0 0 2N2222
D7 12V P004 W5AP-LZMZ-5K8L
R17 P004 P003 80
Q3 P005 N060 0 0 2N2222
D8 12V P006 W5AP-LZMZ-5K8L
R18 P006 P005 80
R19 N057 N022 80k
R20 N060 N037 80k
R21 N025 0 42
R22 12V N025 80
XU1 N025 N016 12V -12V N016 level.2 Avol=1Meg GBW=10Meg Slew=10Meg ilimit=25m rail=0 Vos=0 phimargin=45 en=0 enk=0 in=0 ink=0 Rin=500Meg  ; pins IN+ IN- V+ V- OUT
XU2 N027 N018 12V -12V N019 level.2 Avol=1Meg GBW=10Meg Slew=10Meg ilimit=25m rail=0 Vos=0 phimargin=45 en=0 enk=0 in=0 ink=0 Rin=500Meg  ; pins IN+ IN- V+ V- OUT
XU3 N019 N021 12V -12V N015 level.2 Avol=1Meg GBW=10Meg Slew=10Meg ilimit=25m rail=0 Vos=0 phimargin=45 en=0 enk=0 in=0 ink=0 Rin=500Meg  ; pins IN+ IN- V+ V- OUT
XU4 0 N036 12V -12V N033 level.2 Avol=1Meg GBW=10Meg Slew=10Meg ilimit=25m rail=0 Vos=0 phimargin=45 en=0 enk=0 in=0 ink=0 Rin=500Meg  ; pins IN+ IN- V+ V- OUT
XU8 set N055 12V -12V N056 level.2 Avol=1Meg GBW=10Meg Slew=10Meg ilimit=25m rail=0 Vos=0 phimargin=45 en=0 enk=0 in=0 ink=0 Rin=500Meg  ; pins IN+ IN- V+ V- OUT
XU9 set N061 12V -12V N062 level.2 Avol=1Meg GBW=10Meg Slew=10Meg ilimit=25m rail=0 Vos=0 phimargin=45 en=0 enk=0 in=0 ink=0 Rin=500Meg  ; pins IN+ IN- V+ V- OUT
XU10 set N039 12V -12V N040 level.2 Avol=1Meg GBW=10Meg Slew=10Meg ilimit=25m rail=0 Vos=0 phimargin=45 en=0 enk=0 in=0 ink=0 Rin=500Meg  ; pins IN+ IN- V+ V- OUT
XU11 0 N053 12V -12V N058 level.2 Avol=1Meg GBW=10Meg Slew=10Meg ilimit=25m rail=0 Vos=0 phimargin=45 en=0 enk=0 in=0 ink=0 Rin=500Meg  ; pins IN+ IN- V+ V- OUT
R23 NC_01 N056 10k
R24 N053 N040 10k
R29 N063 N062 10k
R30 N039 temp 1k
R31 N055 N059 1k
R32 N061 temp 100k
R33 N040 N039 20k
R34 N056 N055 10k
C2 N062 N061 1µ
C3 N059 temp 1µ
R35 N058 N053 10k
XU12 temp N009 12V -12V N010 level.2 Avol=1Meg GBW=10Meg Slew=10Meg ilimit=25m rail=0 Vos=0 phimargin=45 en=0 enk=0 in=0 ink=0 Rin=500Meg  ; pins IN+ IN- V+ V- OUT
XU13 temp N023 12V -12V N024 level.2 Avol=1Meg GBW=10Meg Slew=10Meg ilimit=25m rail=0 Vos=0 phimargin=45 en=0 enk=0 in=0 ink=0 Rin=500Meg  ; pins IN+ IN- V+ V- OUT
XU14 temp N001 12V -12V N002 level.2 Avol=1Meg GBW=10Meg Slew=10Meg ilimit=25m rail=0 Vos=0 phimargin=45 en=0 enk=0 in=0 ink=0 Rin=500Meg  ; pins IN+ IN- V+ V- OUT
XU15 0 N005 12V -12V N011 level.2 Avol=1Meg GBW=10Meg Slew=10Meg ilimit=25m rail=0 Vos=0 phimargin=45 en=0 enk=0 in=0 ink=0 Rin=500Meg  ; pins IN+ IN- V+ V- OUT
R37 N005 N002 10k
R38 N005 N024 10k
R39 N001 set 1k
R40 N009 N012 1k
R151 N023 set 100
R42 N002 N001 22k
R43 N010 N009 20k
C4 N024 N023 1µ
C5 N012 set 10µ
R44 N011 N005 10k
C6 N029 N028 1µ
R45 N031 N030 4.7k
R46 N041 N031 1k
R47 0 N041 47k
R48 N029 N028 10k
XU16 N041 N030 12V -12V N031 level.2 Avol=1Meg GBW=10Meg Slew=10Meg ilimit=25m rail=0 Vos=0 phimargin=45 en=0 enk=0 in=0 ink=0 Rin=500Meg  ; pins IN+ IN- V+ V- OUT
R49 N028 N031 1k
R50 N043 0 0
R51 N042 N051 20k
R52 N029 N042 22k
XU17 N043 N028 12V -12V N029 level.2 Avol=1Meg GBW=10Meg Slew=10Meg ilimit=25m rail=0 Vos=0 phimargin=45 en=0 enk=0 in=0 ink=0 Rin=500Meg  ; pins IN+ IN- V+ V- OUT
XU18 N042 N048 12V -12V N017 level.2 Avol=1Meg GBW=10Meg Slew=10Meg ilimit=25m rail=0 Vos=0 phimargin=45 en=0 enk=0 in=0 ink=0 Rin=500Meg  ; pins IN+ IN- V+ V- OUT
R53 N017 N048 4.7k
R54 0 N048 1k
M1 N038 Fan 0 0 AP9465GEM
D9 Fan N054 NSSW008CT-P1
R55 N054 0 1k
R§Fan1 12V N038 60
XU20 PID_Heat N017 12V -12V N020 level.2 Avol=1Meg GBW=10Meg Slew=10Meg ilimit=25m rail=0 Vos=0 phimargin=45 en=0 enk=0 in=0 ink=0 Rin=500Meg  ; pins IN+ IN- V+ V- OUT
M2 N013 Heater 0 0 AP9465GEM
R56 Heater 0 10k
R§Heater1 12V N013 8
XU21 N052 N046 12V -12V N050 level.2 Avol=1Meg GBW=10Meg Slew=10Meg ilimit=25m rail=0 Vos=0 phimargin=45 en=0 enk=0 in=0 ink=0 Rin=500Meg  ; pins IN+ IN- V+ V- OUT
R57 N049 N052 15k
R58 N052 -12V 16k
V4 N051 0 2.5
C7 N030 0 22n
C8 t_meas 0 5m
B1 0 N003 I=V(Heater)*V(Heater)/10
D12 N020 Heater D
D11 N011 PID_Heat D
D13 N058 PID_Fan D
D14 N050 Fan D
R59 PID_Heat 0 1k
R60 PID_Fan 0 1k
XU6 N007 set 12V -12V set level.2 Avol=1Meg GBW=10Meg Slew=10Meg ilimit=25m rail=0 Vos=0 phimargin=45 en=0 enk=0 in=0 ink=0 Rin=500Meg  ; pins IN+ IN- V+ V- OUT
XU7 N006 N008 12V -12V temp level.2 Avol=1Meg GBW=10Meg Slew=10Meg ilimit=25m rail=0 Vos=0 phimargin=45 en=0 enk=0 in=0 ink=0 Rin=500Meg  ; pins IN+ IN- V+ V- OUT
R41 Fan 0 10k
R61 N046 PID_Heat 1k
R62 N026 0 1k
D15 Heater N026 NSSW008CT-P1
R36 N005 N010 10k
V5 N027 0 PULSE(2.1 4 0 50m 50m 1)
R63 12V N047 8.6k
R64 N047 0 2k
XU5 N047 N034 12V -12V N035 lm358  ; pins In+ In- V+ V- OUT
.model D D
.lib standard.dio
.model NPN NPN
.model PNP PNP
.lib standard.bjt
.model NMOS NMOS
.model PMOS PMOS
.lib standard.mos
* RC low pass filter
*       at 60 Hz
* initial amplifier
* buffer for potentiometer
.tran 0 20 1ms 100m
.lib LM358.lib
* offset yok etme direnci
* ↑
.ic V(t_meas)=21  V(C1)=0.21  V(temp)=2.1 V(set)=4
* V=V(t_meas)*0.01
.ic V(C7)=5
.ic V(C5)= 4 V(C4)= 4 V(C3)= 4 V(PID_Heat)= 4
* max 12 v olmadığı için
* ince ayar yap
.lib UniversalOpamps2.sub
.backanno
.end